# Altium project Pump_Driver_Test.PrjPcb
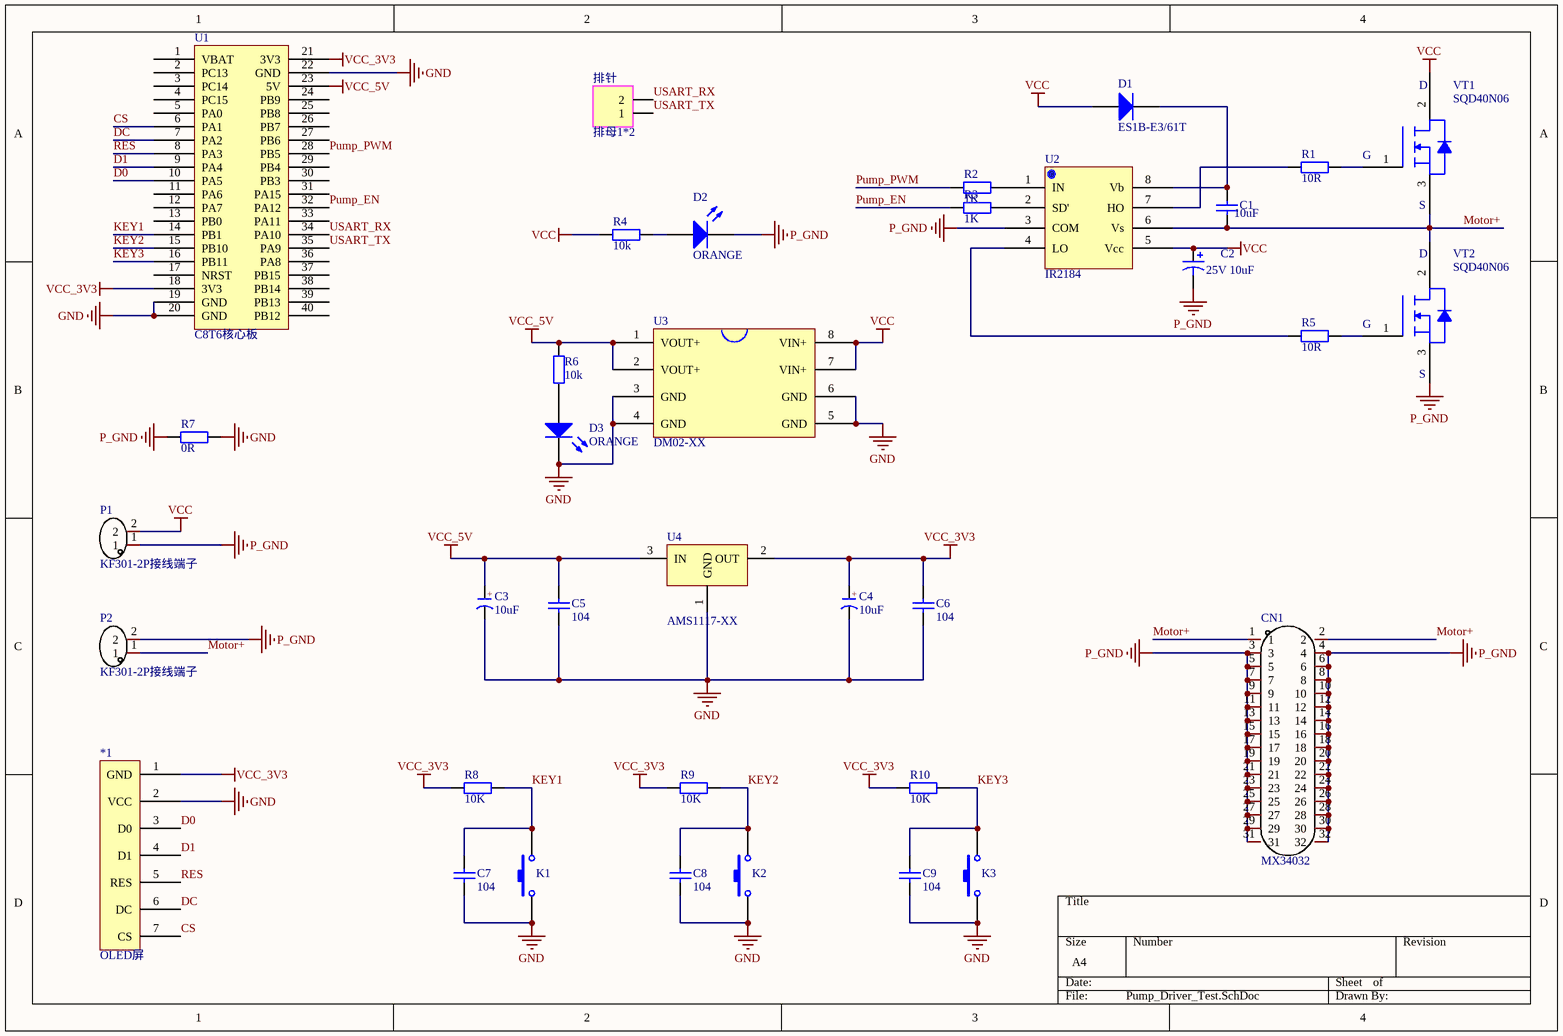
[diagram p0: Pump_Driver_Test.SchDoc]
1 sheet, 36 parts. Net scope: global (net labels, ports and power ports of the same name join across sheets).
Board file: Pump_Driver_Test.PcbDoc

## Sheet Pump_Driver_Test.SchDoc
size A4

### Parts
*1  OLED屏  [HDR2.54-M-LI-7P]
C1  10uF  [C 0805]
C2  25V 10uF  [CP 3528B]
C3  10uF  [CD B(3528)]
C4  10uF  [CD B(3528)]
C5  104  [C 0805]
C6  104  [C 0805]
C7  104  [C 0805]
C8  104  [C 0805]
C9  104  [C 0805]
CN1  Name: MX34032  [CONN-TH_MX34032NF2]  (hidden comment: MX34032NF2)
D1  ES1B-E3/61T  [DO-214]
D2  ORANGE  [LED_0805]
D3  ORANGE  [LED_0805]
K1  Key  [KEY 3.6*2.5 SMD]  (value not drawn)
K2  Key  [KEY 3.6*2.5 SMD]  (value not drawn)
K3  Key  [KEY 3.6*2.5 SMD]  (value not drawn)
P1  KF301-2P接线端子  [CONN-TH_XY301V-A-5.0-2P]
P2  KF301-2P接线端子  [CONN-TH_XY301V-A-5.0-2P]
R1  10R  [R 0805]
R2  1K  [R 0805]
R3  1K  [R 0805]
R4  10k  [R 0805]
R5  10R  [R 0805]
R6  10k  [R 0805]
R7  0R  [R 0805]
R8  10K  [R 0805]
R9  10K  [R 0805]
R10  10K  [R 0805]
U1  C8T6核心板  [c8t6核心板]
U2  IR2184  [SOP8]
U3  DM02-XX  [DM02]
U4  AMS1117-XX  [SOT223]
VT1  SQD40N06  [TO263-3B]
VT2  SQD40N06  [TO263-3B]
排针  排母1*2  [HDR2.54-M-LI-2P]

### Nets
GND: *1.2(VCC) C3.2(K) C4.2(K) C5.2 C6.2 C7.2 C8.2 C9.2 D3.2(K) K1.1 K2.1 K3.1 R7.2 U1.19(GND) U1.20(GND) U1.22(GND) U3.3(GND) U3.4(GND) U3.5(GND) U3.6(GND) U4.1(GND)
P_GND: C2.2 CN1.3 CN1.4 CN1.5 CN1.6 CN1.7 CN1.8 CN1.9 CN1.10 CN1.11 CN1.12 CN1.13 CN1.14 CN1.15 CN1.16 CN1.17 CN1.18 CN1.19 CN1.20 CN1.21 CN1.22 CN1.23 CN1.24 CN1.25 CN1.26 CN1.27 CN1.28 CN1.29 CN1.30 CN1.31 CN1.32 D2.2(K) P1.1 P2.2 R7.1 U2.3(COM) VT2.3
VCC: C2.1 D1.1(A) P1.2 R4.2 U2.5(Vcc) U3.7(VIN+) U3.8(VIN+) VT1.2
VCC_3V3: *1.1(GND) C4.1(A) C6.1 R8.2 R9.2 R10.2 U1.18(3V3) U1.21(3V3) U4.2(OUT)
VCC_5V: C3.1(A) C5.1 R6.2 U1.23(5V) U3.1(VOUT+) U3.2(VOUT+) U4.3(IN)
CS: *1.7(CS) U1.6(PA1)
D0: *1.3(D0) U1.10(PA5)
D1: *1.4(D1) U1.9(PA4)
DC: *1.6(DC) U1.7(PA2)
KEY1: C7.1 K1.2 R8.1 U1.14(PB1)
KEY2: C8.1 K2.2 R9.1 U1.15(PB10)
KEY3: C9.1 K3.2 R10.1 U1.16(PB11)
Motor+: C1.1 CN1.1 CN1.2 P2.1 U2.6(Vs) VT1.3 VT2.2
Pump_EN: R3.1 U1.32(PA12)
Pump_PWM: R2.1 U1.28(PB5)
RES: *1.5(RES) U1.8(PA3)
USART_RX: U1.34(PA10) 排针.2
USART_TX: U1.35(PA9) 排针.1
NetC1_2: C1.2 D1.2(K) U2.8(Vb)
NetD2_1: D2.1(A) R4.1
NetD3_1: D3.1(A) R6.1
NetR1_1: R1.1 U2.7(HO)
NetR1_2: R1.2 VT1.1(G)
NetR2_2: R2.2 U2.1(IN)
NetR3_2: R3.2 U2.2(SD')
NetR5_1: R5.1 U2.4(LO)
NetR5_2: R5.2 VT2.1(G)

Not connected (* = marked no-connect by the designer): U1 1(VBAT) 2(PC13) 3(PC14) 4(PC15) 5(PA0) 11(PA6) 12(PA7) 13(PB0) 17(NRST) 24(PB9) 25(PB8) 26(PB7) 27(PB6) 29(PB4) 30(PB3) 31(PA15) 33(PA11) 36(PA8) 37(PB15) 38(PB14) 39(PB13) 40(PB12)

### Notes on the sheet
- (in symbol PowerMos_N) D; S
- (in symbol 贴片钽电容) +

### Library data of the parts
C1 C5-C9 = Cap: 无极性电容
C2 = Cap_Pol: 极性电容
C3 C4 = 贴片钽电容
CN1 = MX34032NF2: 间距:2.2mm;插针结构:2x16P;排数:2;每排PIN数:16;行距:3mm;公母:公型插针;安装方式:弯插;; Manufacturer: JAE(日本航空电子); Add into BOM: yes; Pitch: 2.2mm; Pins Structure: 2x16P; Number of PINs Per Row: 16; Row Spacing: 3mm; Gender: 公型插针; Symbol: MX34032NF2; Device: MX34032NF2; LCSC Part Name: 2.2mm 2x16P 弯插; Supplier Part: C461464; Manufacturer Part: MX34032NF2; Supplier Footprint: 弯插,P=2.2mm(交错脚); JLCPCB Part Class: 扩展库; Datasheet: https://atta.szlcsc.com/upload/public/pdf/source/20191125/C461464_E16D5CF94FC82895A5208D85BE19BEE8.pdf; Supplier: LCSC; Convert to PCB: yes; Number of Rows: 2; Mounting Style: 弯插
D1 = Diode: 二极管
D2 D3 = LED: 发光二极管
K1-K3 = Key: 按键
P1 P2 = KF301-2P接线端子: Add into BOM: yes; Symbol: KF301-2P接线端子; Device: KF301-2P接线端子; LCSC Part Name: KF301-2P接线端子; Supplier Part: C9900016950; Manufacturer Part: KF301-2P接线端子; Supplier Footprint: CK301-2P; JLCPCB Part Class: 扩展库; Datasheet: https://atta.szlcsc.comnull; Supplier: LCSC; Convert to PCB: yes; Name: KF301-2P接线端子
R1-R10 = Resistor: 电阻
U2 = IR2184: Half-Bridge Gate Driver
U3 = DM02: 开关型DC-DC变换器
U4 = AMS1117: 线性稳压器
VT1 VT2 = PowerMos_N